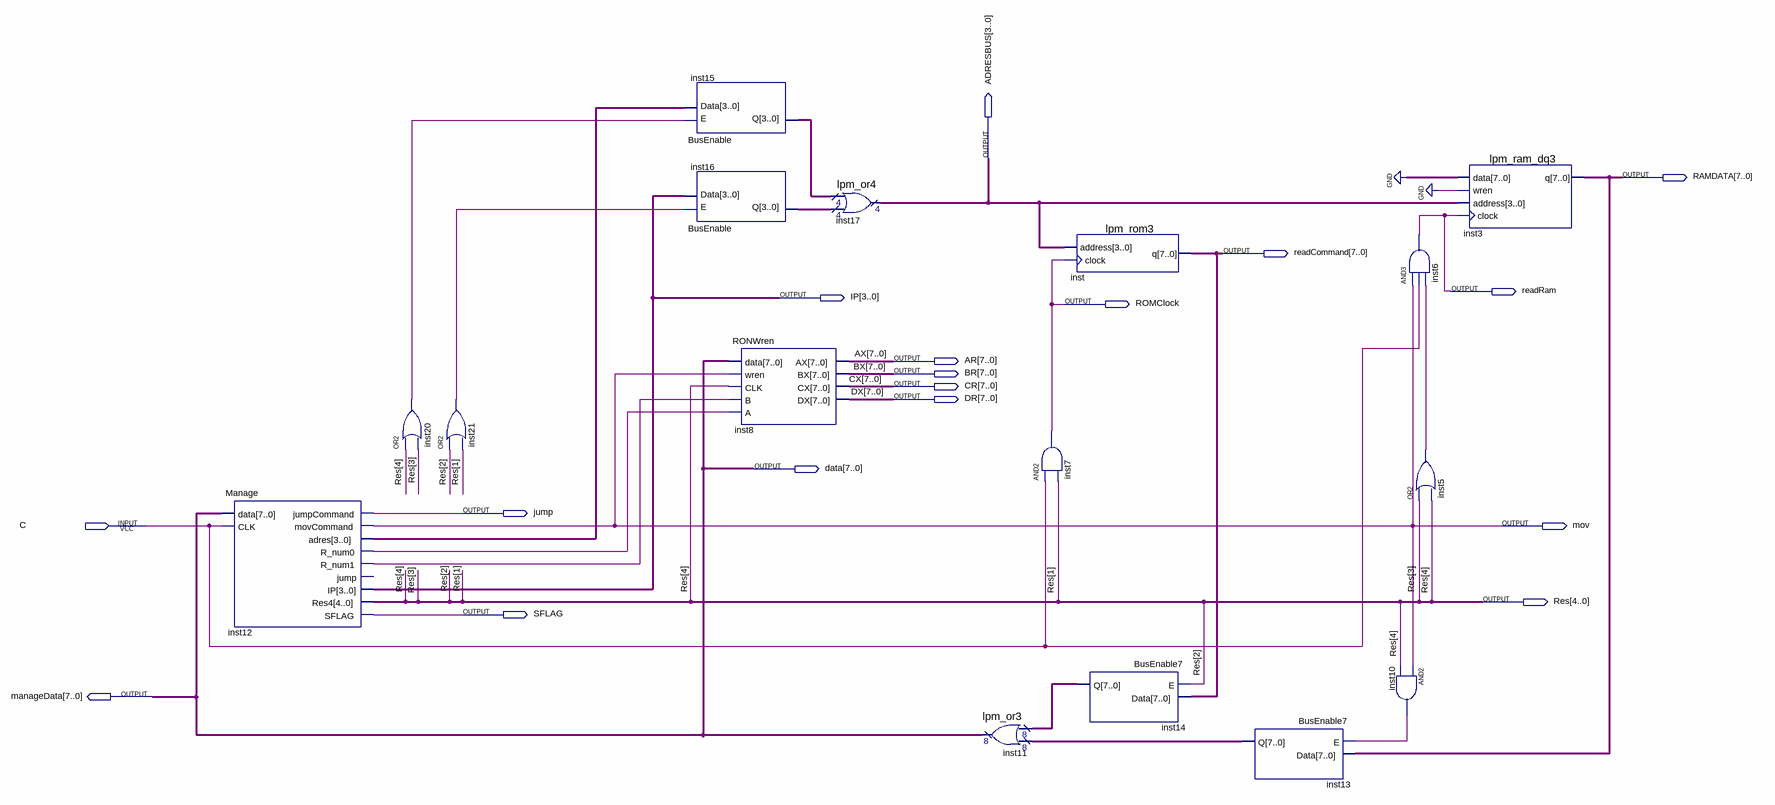
[diagram p0: schematic sheet]
// Quartus schematic SIFL4.bdf as structural Verilog: 16 symbols, 17 pins
module SIFL4 (
  input  C,
  output [3:0] ADRESBUS,
  output [7:0] RAMDATA,
  output [7:0] readCommand,
  output readRam,
  output [3:0] IP,
  output ROMClock,
  output [7:0] AR,
  output [7:0] BR,
  output [7:0] CR,
  output [7:0] DR,
  output [7:0] data,
  output jump,
  output mov,
  output [4:0] Res,
  output SFLAG,
  output [7:0] manageData
);

  wire inst5_out, inst10_out, inst12_r_num0, inst12_r_num1, inst20_out, inst21_out;
  wire [3:0] inst12_adres, inst15_q, inst16_q;
  wire [7:0] inst13_q, inst14_q;

  Manage inst12 (
    .data(data), .CLK(C), .jumpCommand(jump), .movCommand(mov), .adres(inst12_adres), .R_num0(inst12_r_num0),
    .R_num1(inst12_r_num1), .IP(IP), .Res4(Res), .SFLAG(SFLAG));  // open: jump
  or inst20 (inst20_out, Res[4], Res[3]);
  or inst21 (inst21_out, Res[2], Res[1]);
  BusEnable inst15 (.E(inst20_out), .Data(inst12_adres), .Q(inst15_q));
  BusEnable inst16 (.E(inst21_out), .Data(IP), .Q(inst16_q));
  RONWren inst8 (
    .data(data), .wren(mov), .CLK(Res[4]), .B(inst12_r_num1), .A(inst12_r_num0), .AX(AR), .BX(BR), .CX(CR),
    .DX(DR));
  lpm_or4 inst17 (.data0x(inst15_q), .data1x(inst16_q), .result(ADRESBUS));
  lpm_or3 inst11 (.data0x(inst14_q), .data1x(inst13_q), .result(data));
  and inst7 (ROMClock, C, Res[1]);
  lpm_rom3 inst (.address(ADRESBUS), .clock(ROMClock), .q(readCommand));
  BusEnable7 inst14 (.E(Res[2]), .Data(readCommand), .Q(inst14_q));
  BusEnable7 inst13 (.E(inst10_out), .Data(RAMDATA), .Q(inst13_q));
  and inst6 (readRam, mov, C, inst5_out);
  or inst5 (inst5_out, Res[3], Res[4]);
  and inst10 (inst10_out, mov, Res[4]);
  lpm_ram_dq3 inst3 (.data({8{1'b0}}), .wren(1'b0), .address(ADRESBUS), .clock(readRam), .q(RAMDATA));

  assign manageData = data;

  // Other names for the same wires on the sheet: AX[7:0] = AR; BX[7:0] = BR; CX[7:0] = CR; DX[7:0] = DR
endmodule
